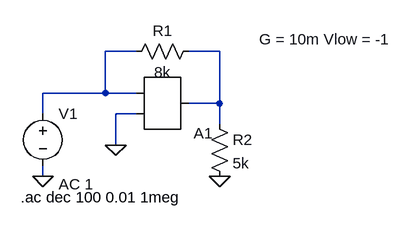
[diagram p0: schematic EJ3d.asc]
EJ3d.asc, the LTspice schematic file:
Version 4
SHEET 1 880 680
WIRE 128 64 80 64
WIRE 256 64 208 64
WIRE 80 128 80 64
WIRE 80 128 -16 128
WIRE 128 128 80 128
WIRE 256 144 256 64
WIRE 256 144 208 144
WIRE -16 160 -16 128
WIRE 128 160 96 160
WIRE 256 176 256 144
WIRE 96 208 96 160
WIRE -16 256 -16 240
FLAG 96 208 0
FLAG 256 256 0
FLAG -16 256 0
SYMBOL SpecialFunctions\\ota 160 208 M180
WINDOW 3 157 163 Left 2
SYMATTR InstName A1
SYMATTR Value G = 10m Vlow = -1
SYMBOL res 224 48 R90
WINDOW 0 0 56 VBottom 2
WINDOW 3 32 56 VTop 2
SYMATTR InstName R1
SYMATTR Value 8k
SYMBOL res 240 160 R0
SYMATTR InstName R2
SYMATTR Value 5k
SYMBOL voltage -16 144 R0
WINDOW 123 24 124 Left 2
WINDOW 39 0 0 Left 0
SYMATTR InstName V1
SYMATTR Value ""
SYMATTR Value2 AC 1
TEXT -50 288 Left 2 !.ac dec 100 0.01 1meg

The netlist it stands for:
* EJ3d.asc
A1 0 N001 0 0 0 0 N002 0 OTA G = 10m Vlow = -1
R1 N002 N001 8k
R2 N002 0 5k
V1 N001 0 AC 1
.ac dec 100 0.01 1meg
.backanno
.end